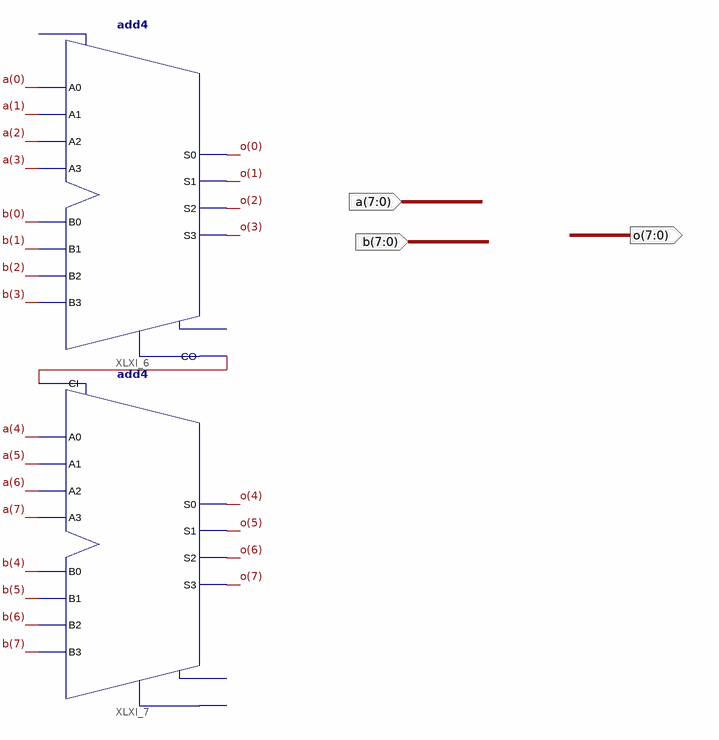
[diagram p0: schematic sheet 1]
// Xilinx ISE schematic full_adder_8bit.sch (spartan6) as structural Verilog: 2 symbols, 3 ports
module full_adder_8bit (
  input  [7:0] a,
  input  [7:0] b,
  output [7:0] o
);

  wire XLXN_17;

  add4 XLXI_6 (
    .A0(a[0]), .A1(a[1]), .A2(a[2]), .A3(a[3]), .B0(b[0]), .B1(b[1]), .B2(b[2]), .B3(b[3]), .CO(XLXN_17),
    .S0(o[0]), .S1(o[1]), .S2(o[2]), .S3(o[3]));  // open: CI, OFL
  add4 XLXI_7 (
    .A0(a[4]), .A1(a[5]), .A2(a[6]), .A3(a[7]), .B0(b[4]), .B1(b[5]), .B2(b[6]), .B3(b[7]), .CI(XLXN_17),
    .S0(o[4]), .S1(o[5]), .S2(o[6]), .S3(o[7]));  // open: CO, OFL
endmodule
